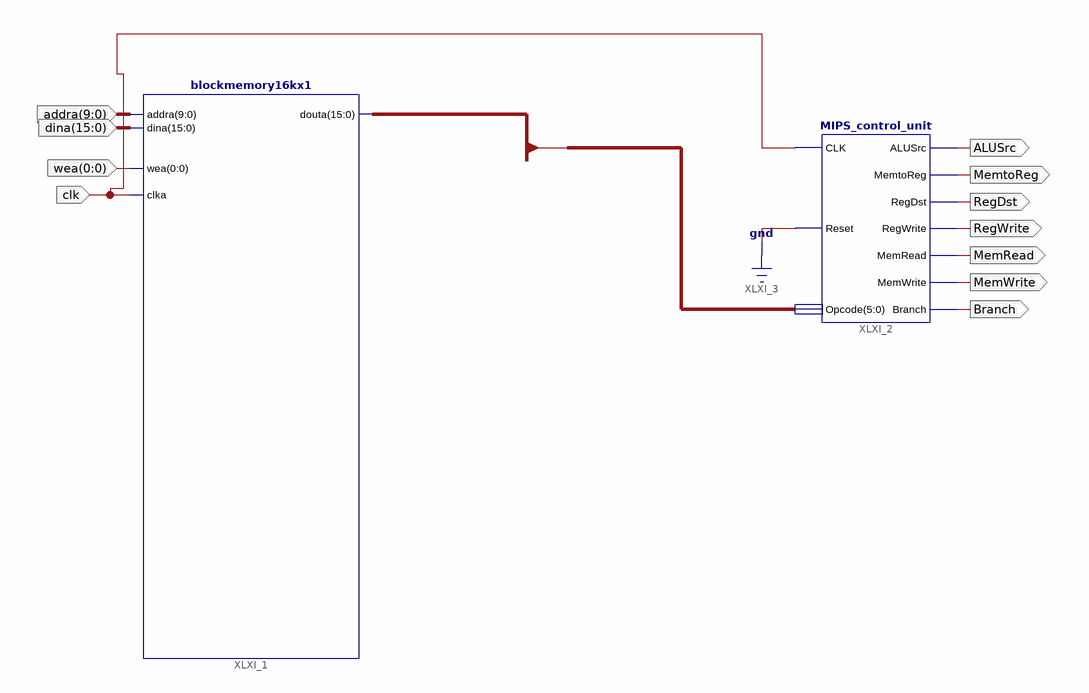
[diagram p0: schematic sheet 1]
// Xilinx ISE schematic MemoryControl.sch (spartan3e) as structural Verilog: 2 symbols, 11 ports
module MemoryControl (
  input  [9:0] addra,
  input  [15:0] dina,
  input  [0:0] wea,
  input  clk,
  output ALUSrc,
  output MemtoReg,
  output RegDst,
  output RegWrite,
  output MemRead,
  output MemWrite,
  output Branch
);

  wire [15:0] douta;

  blockmemory16kx1 XLXI_1 (.addra(addra), .dina(dina), .wea(wea[0]), .clka(clk), .douta(douta));
  MIPS_control_unit XLXI_2 (
    .CLK(clk), .Reset(1'b0), .Opcode(douta[5:0]), .ALUSrc(ALUSrc), .MemtoReg(MemtoReg), .RegDst(RegDst),
    .RegWrite(RegWrite), .MemRead(MemRead), .MemWrite(MemWrite), .Branch(Branch));
endmodule
